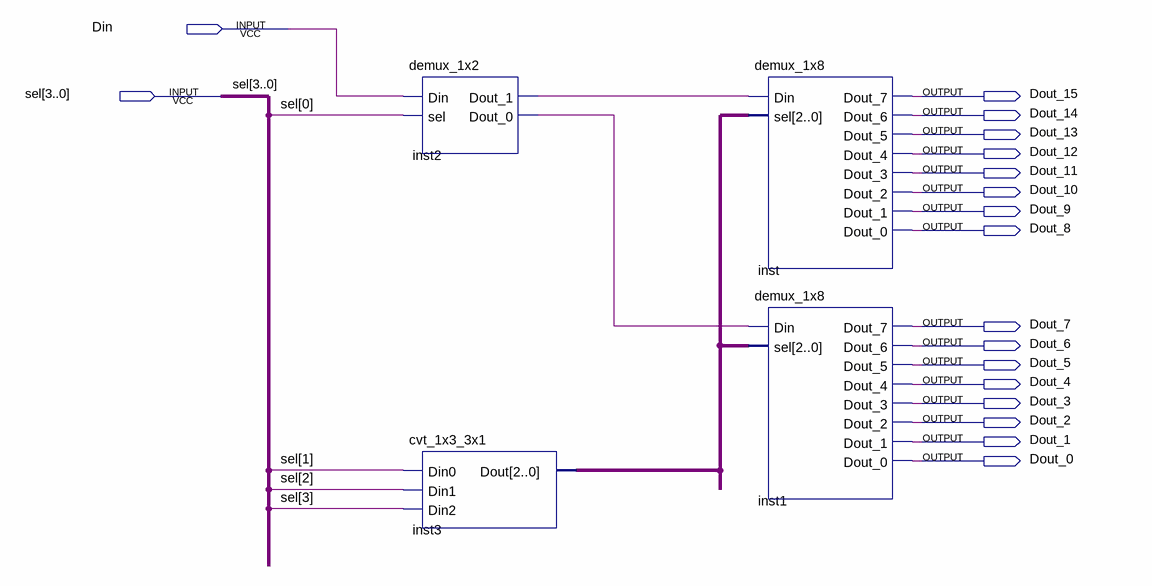
[diagram p0: schematic sheet]
// Quartus schematic demux_1x16.bdf as structural Verilog: 4 symbols, 18 pins
module demux_1x16 (
  input  Din,
  input  [3:0] sel,
  output Dout_15,
  output Dout_14,
  output Dout_13,
  output Dout_12,
  output Dout_11,
  output Dout_10,
  output Dout_9,
  output Dout_8,
  output Dout_7,
  output Dout_6,
  output Dout_5,
  output Dout_4,
  output Dout_3,
  output Dout_2,
  output Dout_1,
  output Dout_0
);

  wire inst2_dout_0, inst2_dout_1;
  wire [2:0] inst3_dout;

  demux_1x2 inst2 (.Din(Din), .sel(sel[0]), .Dout_1(inst2_dout_1), .Dout_0(inst2_dout_0));
  cvt_1x3_3x1 inst3 (.Din0(sel[1]), .Din1(sel[2]), .Din2(sel[3]), .Dout(inst3_dout));
  demux_1x8 inst (
    .Din(inst2_dout_1), .sel(inst3_dout), .Dout_7(Dout_15), .Dout_6(Dout_14), .Dout_5(Dout_13),
    .Dout_4(Dout_12), .Dout_3(Dout_11), .Dout_2(Dout_10), .Dout_1(Dout_9), .Dout_0(Dout_8));
  demux_1x8 inst1 (
    .Din(inst2_dout_0), .sel(inst3_dout), .Dout_7(Dout_7), .Dout_6(Dout_6), .Dout_5(Dout_5), .Dout_4(Dout_4),
    .Dout_3(Dout_3), .Dout_2(Dout_2), .Dout_1(Dout_1), .Dout_0(Dout_0));
endmodule
